# Altium project Zotino.PrjPCB (part 2 of 3)

## Sheet Supply_DAC.SchDoc: Zotino
size 420 x 297 mm; Author: G.K.; CompanyName: WUT; DrawnBy: G.K.; Organization: WUT ISE; Address1: Warsaw Univeristy of Technology; Address2: Nowowiejska 15/19; DocumentNumber: 6; Revision: 1.4.3; SheetNumber: 6; SheetTotal: 6; EDA_Number: ARTIQ; Projet: Zotino; ModifiedBy: -; CreateDate: XX/XX/XXXX; CheckedDate: -; Title2: Power supply; DivGrp: ISE; Designer: G.K.; ModifiedDate: -; ProjectName: 32 CHANNEL 16bit DAC
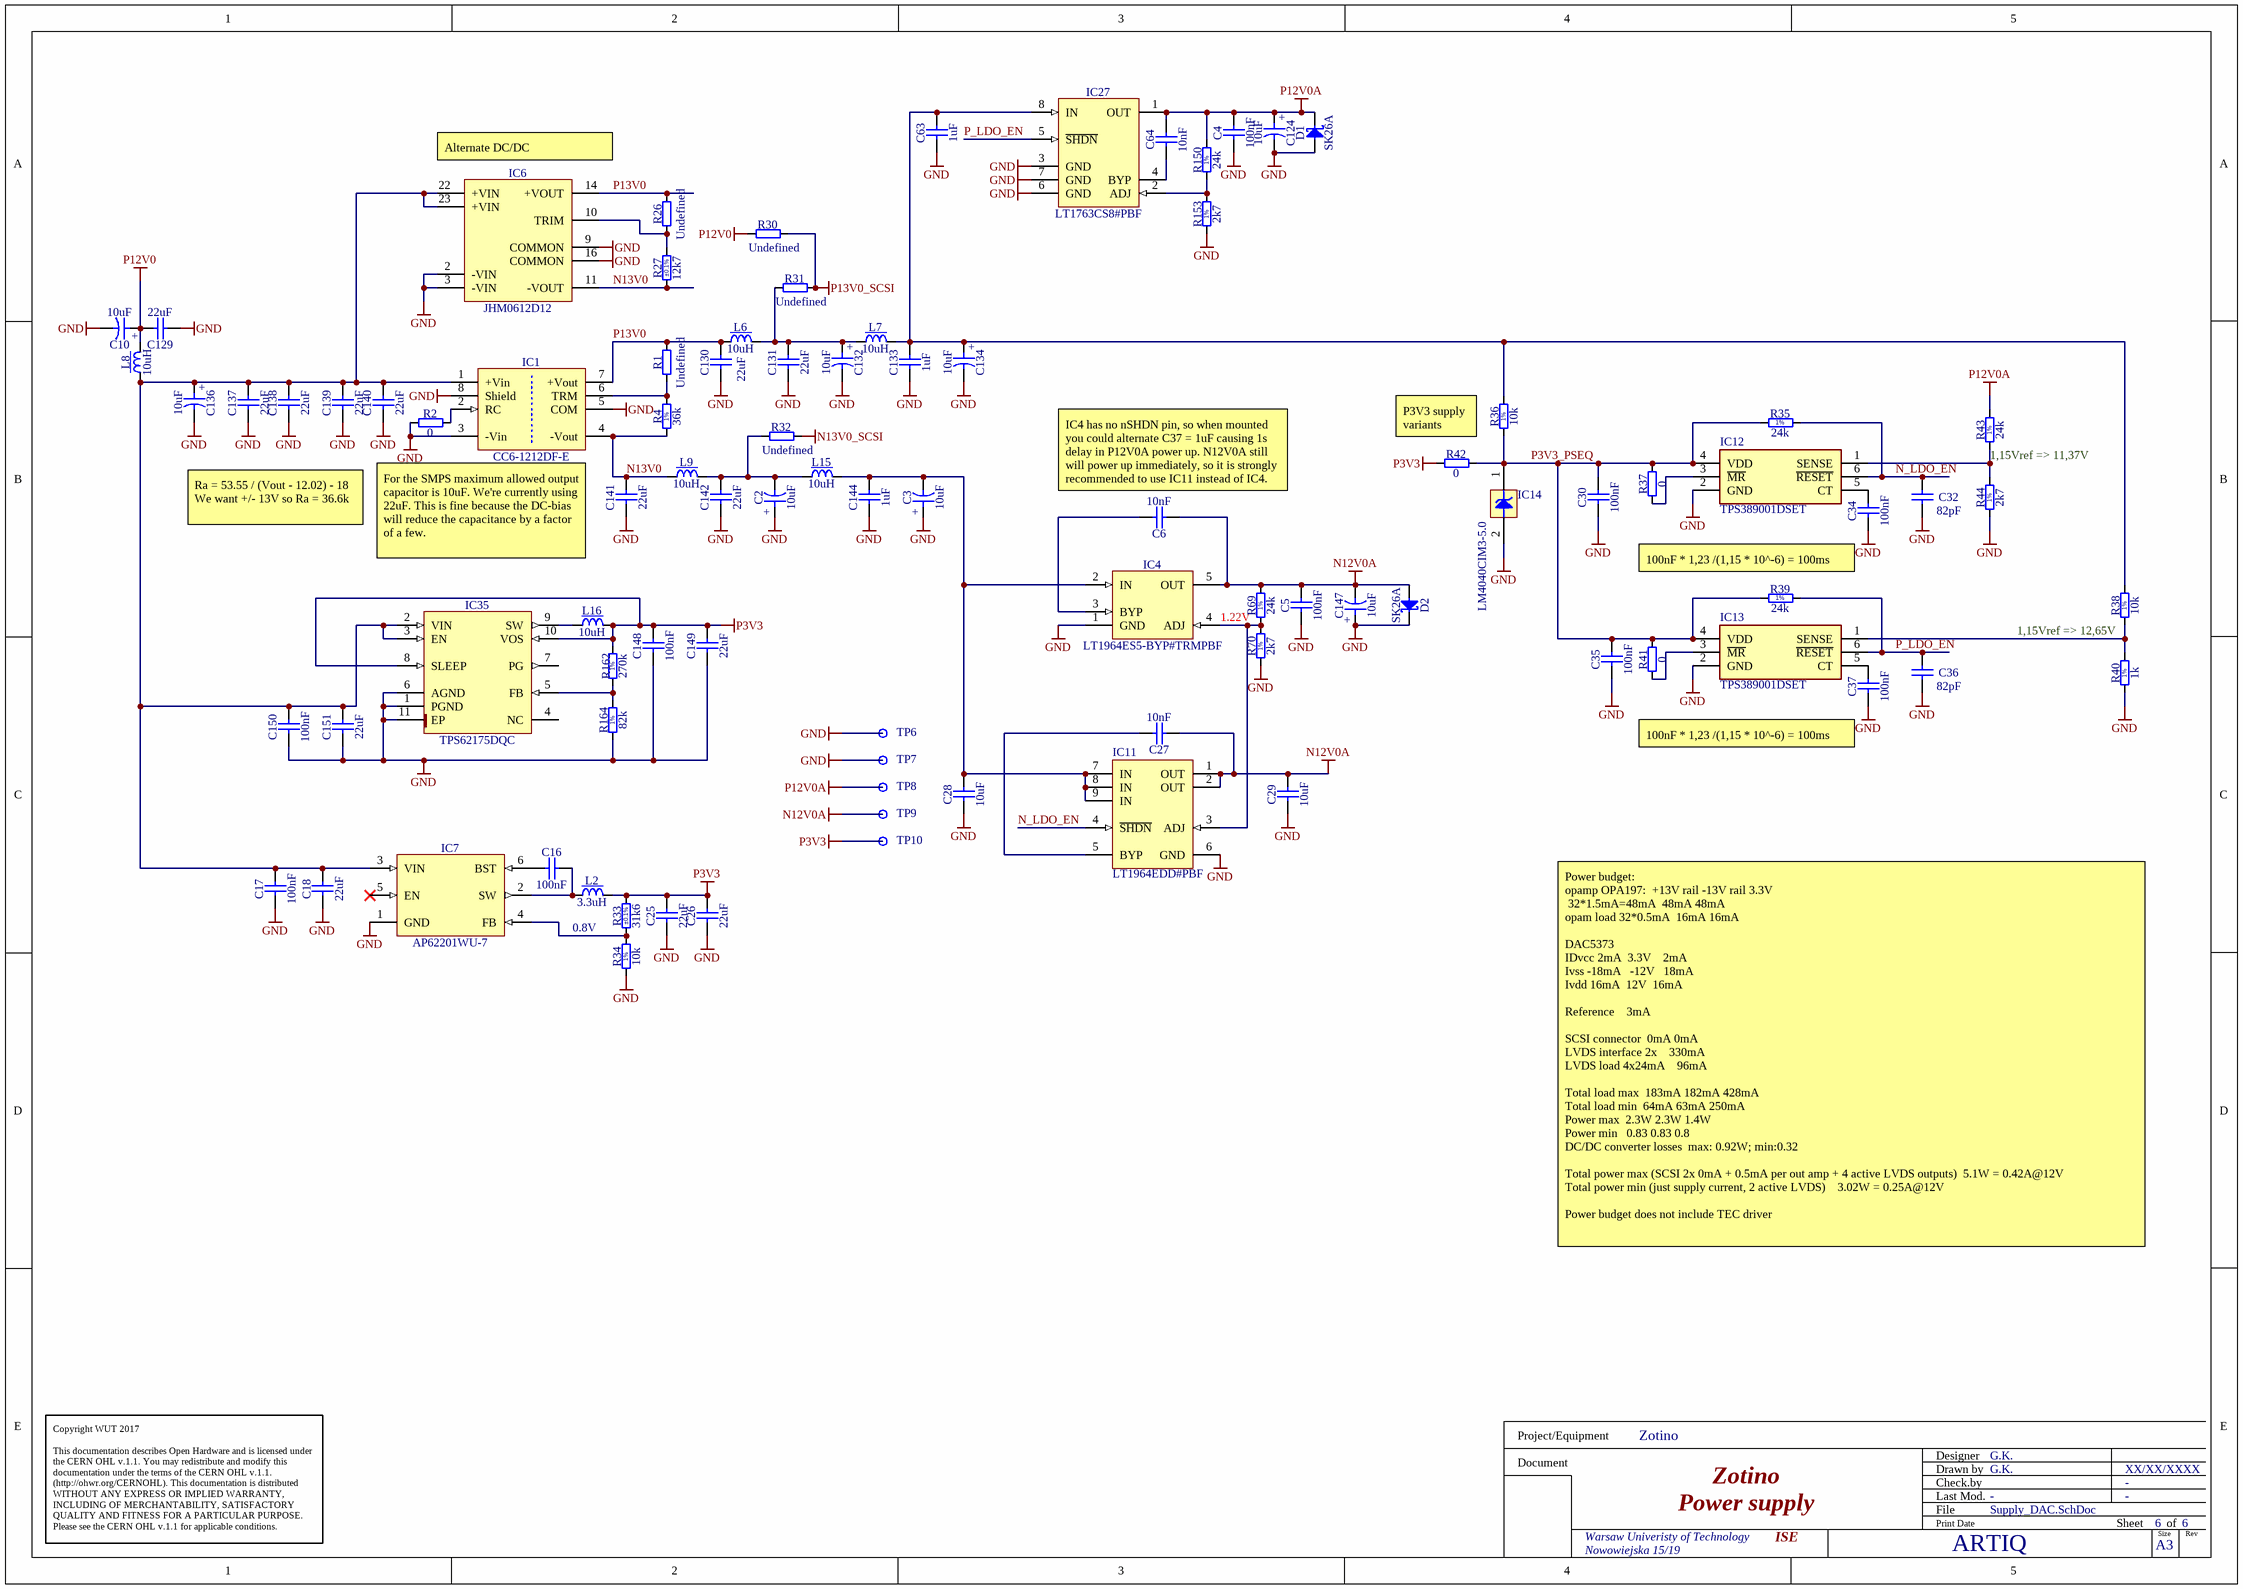
[diagram p1: Supply_DAC.SchDoc]

### Parts
C2  10uF  [CAPMP3216X180N]
C3  10uF  [CAPMP3216X180N]
C4  100nF  [CAPC1005X55N]
C5  100nF  [CAPC1005X55N]
C6  10nF  [CAPC1608X87N]
C10  10uF  [CAPMP3216X180N]
C16  100nF  [CAPC1005X55N]
C17  100nF  [CAPC1005X55N]
C18  22uF  [CAPC2012X135N]
C25  22uF  [CAPC2012X135N]
C26  22uF  [CAPC2012X135N]
C27  10nF  [CAPC1608X87N]
C28  10uF  [CAPC1608X80N]
C29  10uF  [CAPC1608X80N]
C30  100nF  [CAPC1005X55N]
C32  82pF  [CAPC1608X87N]
C34  100nF  [CAPC1005X55N]
C35  100nF  [CAPC1005X55N]
C36  82pF  [CAPC1608X87N]
C37  100nF  [CAPC1005X55N]
C63  1uF  [CAPC1608X87N]
C64  10nF  [CAPC1608X87N]
C124  10uF  [CAPMP3216X180N]
C129  22uF  [CAPC2012X135N]
C130  22uF  [CAPC2012X135N]
C131  22uF  [CAPC2012X135N]
C132  10uF  [CAPMP3216X180N]
C133  1uF  [CAPC1608X87N]
C134  10uF  [CAPMP3216X180N]
C136  10uF  [CAPMP3216X180N]
C137  22uF  [CAPC2012X135N]
C138  22uF  [CAPC2012X135N]
C139  22uF  [CAPC2012X135N]
C140  22uF  [CAPC2012X135N]
C141  22uF  [CAPC2012X135N]
C142  22uF  [CAPC2012X135N]
C144  1uF  [CAPC1608X87N]
C147  10uF  [CAPMP3216X180N]
C148  100nF  [CAPC1005X55N]
C149  22uF  [CAPC2012X135N]
C150  100nF  [CAPC1005X55N]
C151  22uF  [CAPC2012X135N]
D1  SK26A  [DIOM5126X265N]
D2  SK26A  [DIOM5126X265N]
IC1  CC6-1212DF-E  [CC6-1212DF-E]
IC4  LT1964ES5-BYP#TRMPBF  [SOT95P280X100-5N]
IC6  JHM0612D12  [DCDC_XPPOWER_JHM0X]
IC7  AP62201WU-7  [SOT95P280X100-6N]
IC11  LT1964EDD#PBF  [LT-DD-8_V]
IC12  TPS389001DSET  [TPS610985DSET]
IC13  TPS389001DSET  [TPS610985DSET]
IC14  LM4040CIM3-5.0  [SOT95P237X112-3N]
IC27  LT1763CS8#PBF  [SOIC127P600X175-8N]
IC35  TPS62175DQC  [SON50P200X300X80-11N-R94X250]
L2  3.3uH  [IND_WURTH_WE-TPC_4828]
L6  10uH  [IND_MURATA-PS_8400]
L7  10uH  [IND_MURATA-PS_8400]
L8  10uH  [IND_MURATA-PS_8400]
L9  10uH  [IND_MURATA-PS_8400]
L15  10uH  [IND_MURATA-PS_8400]
L16  10uH  [IND_MURATA-PS_8400]
R1  Undefined  [RESC1608X55N]
R2  0  [RESC1005X40N]
R4  36k  [RESC1608X55N]
R26  Undefined  [RESC1608X55N]
R27  12k7  Tolerance: ±0.1%  [RESC1608X55N]
R30  Undefined  [RESC3216X65N]
R31  Undefined  [RESC3216X65N]
R32  Undefined  [RESC3216X65N]
R33  31k6  Tolerance: ±0.1%  [RESC1005X35N]
R34  10k  [RESC1005X40N]
R35  24k  [RESC1608X55N]
R36  10k  [RESC1005X40N]
R37  0  [RESC1005X40N]
R38  10k  [RESC1005X40N]
R39  24k  [RESC1608X55N]
R40  1k  [RESC1608X55N]
R41  0  [RESC1005X40N]
R42  0  [RESC1005X40N]
R43  24k  [RESC1608X55N]
R44  2k7  [RESC1608X55N]
R69  24k  [RESC1608X55N]
R70  2k7  [RESC1608X55N]
R150  24k  [RESC1608X55N]
R153  2k7  [RESC1608X55N]
R162  270k  [RESC1608X55N]
R164  82k  [RESC1608X55N]
TP6  Test Point  [TPS127]  (value not drawn)  (no BOM)
TP7  Test Point  [TPS127]  (value not drawn)  (no BOM)
TP8  Test Point  [TPS127]  (value not drawn)  (no BOM)
TP9  Test Point  [TPS127]  (value not drawn)  (no BOM)
TP10  Test Point  [TPS127]  (value not drawn)  (no BOM)

### Nets
GND: C2.1 C3.1 C4.1 C5.1 C10.2 C17.1 C18.1 C25.1 C26.1 C28.1 C29.1 C30.1 C32.1 C34.1 C35.1 C36.1 C37.1 C63.1 C124.2 C129.1 C130.1 C131.1 C132.2 C133.1 C134.2 C136.2 C137.1 C138.1 C139.1 C140.1 C141.1 C142.1 C144.1 C147.1 C148.1 C149.1 C150.1 C151.1 D1.2(A) D2.1(C) IC1.3(-Vin) IC1.5(COM) IC1.8(Shield) IC4.1(GND) IC6.2(-VIN) IC6.3(-VIN) IC6.9(COMMON) IC6.16(COMMON) IC7.1(GND) IC11.6(GND) IC12.2(GND) IC13.2(GND) IC14.2(A) IC27.3(GND) IC27.6(GND) IC27.7(GND) IC35.1(PGND) IC35.6(AGND) IC35.11(EP) R2.1 R34.1 R40.1 R44.1 R70.1 R153.1 R164.1 TP6.1 TP7.1
N12V0A: C5.2 C6.1 C27.1 C29.2 C147.2 D2.2(A) IC4.5(OUT) IC11.1(OUT) IC11.2(OUT) R69.2 TP9.1
N13V0_SCSI: R32.2
P3V3: C25.2 C26.2 C148.2 C149.2 IC35.8(SLEEP) IC35.10(VOS) L2.2 L16.2 R33.2 R42.1 R162.2 TP10.1
P12V0: C10.1 C129.2 L8.2 R30.1
P12V0A: C4.2 C64.2 C124.1 D1.1(C) IC27.1(OUT) R43.2 R150.2 TP8.1
P13V0_SCSI: R30.2 R31.2
N13V0: C141.2 IC1.4(-Vout) IC6.11(-VOUT) L9.1 R4.1 R27.1
N_LDO_EN: C32.2 IC11.4(~{SHDN}) IC12.6(~{RESET}) R35.2
P3V3_PSEQ: C30.2 C35.2 IC12.4(VDD) IC13.4(VDD) IC14.1(C) R35.1 R36.1 R37.2 R39.1 R41.2 R42.2
P13V0: C130.2 IC1.7(+Vout) IC6.14(+VOUT) L6.1 R1.2 R26.2
P_LDO_EN: C36.2 IC13.6(~{RESET}) IC27.5(~{SHDN}) R39.2
NetC2_2: C2.2 C142.2 L9.2 L15.1 R32.1
NetC3_2: C3.2 C28.2 C144.2 IC4.2(IN) IC11.7(IN) IC11.8(IN) IC11.9(IN) L15.2
NetC6_2: C6.2 IC4.3(BYP)
NetC16_1: C16.1 IC7.6(BST)
NetC16_2: C16.2 IC7.2(SW) L2.1
NetC17_2: C17.2 C18.2 C136.1 C137.2 C138.2 C139.2 C140.2 C150.2 C151.2 IC1.1(+Vin) IC6.22(+VIN) IC6.23(+VIN) IC7.3(VIN) IC35.2(VIN) IC35.3(EN) L8.1
NetC27_2: C27.2 IC11.5(BYP)
NetC34_2: C34.2 IC12.5(CT)
NetC37_2: C37.2 IC13.5(CT)
NetC63_2: C63.2 C133.2 C134.1 IC27.8(IN) L7.2 R36.2 R38.2
NetC64_1: C64.1 IC27.4(BYP)
NetC131_2: C131.2 C132.1 L6.2 L7.1 R31.1
NetIC1_2: IC1.2(RC) R2.2
NetIC1_6: IC1.6(TRM) R1.1 R4.2
NetIC4_4: IC4.4(ADJ) IC11.3(ADJ) R69.1 R70.2
NetIC6_10: IC6.10(TRIM) R26.1 R27.2
NetIC7_4: IC7.4(FB) R33.1 R34.2
NetIC12_1: IC12.1(SENSE) R43.1 R44.2
NetIC12_3: IC12.3(~{MR}) R37.1
NetIC13_1: IC13.1(SENSE) R38.1 R40.2
NetIC13_3: IC13.3(~{MR}) R41.1
NetIC27_2: IC27.2(ADJ) R150.1 R153.2
NetIC35_5: IC35.5(FB) R162.1 R164.2
NetIC35_9: IC35.9(SW) L16.1

Not connected (* = marked no-connect by the designer): IC7 5(EN)*; IC35 4(NC) 7(PG)

### Notes on the sheet
- (near IC6) Alternate DC/DC
  Trim +10%, R27=12.8k
- P3V3 supply
  variants
- (near R43) 1,15Vref => 11,37V
- Ra = 53.55 / (Vout - 12.02) - 18
  We want +/- 13V so Ra = 36.6k
- (near C6) IC4 has no nSHDN pin, so when mounted you could alternate C37 = 1uF causing 1s delay in P12V0A power up. N12V0A still will power up immediately, so it is strongly recommended to use IC11 instead of IC4.
- For the SMPS maximum allowed output capacitor is 10uF. We're currently using 22uF. This is fine because the DC-bias will reduce the capacitance by a factor of a few.
- 100nF * 1,23 /(1,15 * 10^-6) = 100ms
- 1.22V
- (near R38) 1,15Vref => 12,65V
- 0.8V
- Power budget:
  opamp OPA197:		+13V rail	-13V rail	3.3V
  32*1.5mA=48mA		48mA	48mA
  opam load	32*0.5mA		16mA	16mA
  DAC5373
  IDvcc 2mA  3.3V				2mA
  Ivss -18mA   -12V			18mA
  Ivdd 16mA  12V		16mA
  Reference 			3mA
  SCSI connector		0mA	0mA
  LVDS interface 2x				330mA
  LVDS load 4x24mA				96mA
  Total load	max		183mA	182mA	428mA
  Total load min		64mA	63mA	250mA
  Power max		2.3W	2.3W	1.4W
  Power min			0.83	0.83	0.8
  DC/DC converter losses 	max: 0.92W; min:0.32
  Total power max (SCSI 2x 0mA + 0.5mA per out amp + 4 active LVDS outputs) 	5.1W = 0.42A@12V
  Total power min (just supply current, 2 active LVDS)				3.02W = 0.25A@12V
  Power budget does not include TEC driver
- Copyright WUT 2017
  This documentation describes Open Hardware and is licensed under the CERN OHL v.1.1. You may redistribute and modify this documentation under the terms of the CERN OHL v.1.1. (http://ohwr.org/CERNOHL). This documentation is distributed WITHOUT ANY EXPRESS OR IMPLIED WARRANTY, INCLUDING OF MERCHANTABILITY, SATISFACTORY QUALITY AND FITNESS FOR A PARTICULAR PURPOSE. Please see the CERN OHL v.1.1 for applicable conditions.
- Project/Equipment
- Document
- Designer
- Drawn by
- Check.by
- File
- Last Mod.
- Print Date
- Sheet
- Size
- A3
- of
- Rev
- (in symbol CTE3216-18_10UF_16V_20%_AVX_TCJ) +
- (in symbol R0402_10K_1%_0.0625W_100PPM) 1%
- (in symbol R0603_1K_1%_0.1W_100PPM) 1%
- (in symbol R0603_2K7_1%_0.1W_100PPM) 1%
- (in symbol R0603_24K_1%_0.1W_100PPM) 1%
- (in symbol R0603_36K_1%_0.1W_100PPM) 1%
- (in symbol R0603_82K_1%_0.1W_100PPM) 1%
- (in symbol R0603_270K_1%_0.1W_100PPM) 1%

### Library data of the parts
C2 C3 C10 C124 C132 C134 C136 C147 = CTE3216-18_10UF_16V_20%_AVX_TCJ: Polarised capacitor; Part Description: ESR 0R200 Tantalum Solid Electrolytic Chip Capacitor with Conductive Polymer Electrode; Manufacturer: AVX; Manufacturer Part Number: TCJA106M016R0200; Voltage: 16V; Tolerance: ±20%; Part Number: CTE3216-18_10UF_16V_20%_AVX_TCJ; Component Kind: Standard; Component Type: Standard; Pin Count: 2; Value: 10uF; Status: Preferred; Case: A; Mounted: Yes; Socket: No; SMD: Yes; Sense: No; ComponentHeight: 1.8mm; HelpURL: \\cern.ch\dfs\Applications\Altium\Datasheets\CTE_AVX_TCJ.pdf; Author: CERN DEM JLC; CreateDate: 29.03.2012; LatestRevisionDate: 29.03.2012
C4 C5 C16 C17 C30 C34 C35 C37 C148 C150 = CC0402_100NF_16V_10%_X5R: Non-polarised capacitor; Part Description: SMD Multilayer Chip Ceramic Capacitor; Manufacturer: GENERIC; Manufacturer1 Part Number: GRM155R61C104KA88D; Voltage: 16V; TC: X5R; Tolerance: ±10%; Part Number: CC0402_100NF_16V_10%_X5R; Component Kind: Standard; Component Type: Standard; Pin Count: 2; Value: 100nF; Status: None; Manufacturer Part Number: CC0402_100NF_16V_10%_X5R; Case: 0402; Mounted: Yes; Socket: No; SMD: Yes; Sense: No; Manufacturer1 Example: MURATA; Manufacturer1 ComponentHeight: 0.55mm; HelpURL: \\cern.ch\dfs\Applications\Altium\Datasheets\CC0402_X5R_MURATA_GRM.pdf; Author: CERN DEM JLC; CreateDate: 10.12.2013; LatestRevisionDate: 10.12.2013
C6 C27 C64 = CC0603_10NF_50V_10%_X7R: Non-polarised capacitor; Part Description: SMD Multilayer Chip Ceramic Capacitor; Manufacturer: GENERIC; Manufacturer1 Part Number: 223858615636; Voltage: 50V; TC: X7R; Tolerance: ±10%; Part Number: CC0603_10NF_50V_10%_X7R; Component Kind: Standard; Component Type: Standard; Pin Count: 2; Value: 10nF; Status: Preferred; Manufacturer Part Number: CC0603_10NF_50V_10%_X7R; Case: 0603; Mounted: Yes; Socket: No; SMD: Yes; Sense: No; Manufacturer1 Example: PHYCOMP; Manufacturer1 ComponentHeight: 0.87mm; HelpURL: \\cern.ch\dfs\Applications\Altium\Datasheets\CC0603_X7R_PHYCOMP.pdf; Author: CERN DEM JLC; CreateDate: 03.12.2007; LatestRevisionDate: 03.12.2007
C18 C25 C26 C129-C131 C137-C142 C149 C151 = CC0805_22UF_16V_10%_X5R: Non-polarised capacitor; Part Description: SMD Multilayer Chip Ceramic Capacitor; Manufacturer: GENERIC; Manufacturer1 Part Number: C2012X5R1C226KT; Voltage: 16V; TC: X5R; Tolerance: ±10%; Part Number: CC0805_22UF_16V_10%_X5R; Component Kind: Standard; Component Type: Standard; Pin Count: 2; Value: 22uF; Status: Preferred; Manufacturer Part Number: CC0805_22UF_16V_10%_X5R; Case: 0805; Mounted: Yes; Socket: No; SMD: Yes; Sense: No; Manufacturer1 Example: TDK; Manufacturer1 ComponentHeight: 1.35mm; HelpURL: \\cern.ch\dfs\Applications\Altium\Datasheets\CC0805_X5R_TDK_C.pdf; Author: CERN DEM JLC; CreateDate: 25.10.2012; LatestRevisionDate: 25.10.2012
C28 C29 = CC0603_10UF_16V_20%_X5R: Non-polarised capacitor; Part Description: SMD Multilayer Chip Ceramic Capacitor; Manufacturer: GENERIC; Manufacturer1 Part Number: GRM188R61C106MA73D; Voltage: 16V; TC: X5R; Tolerance: ±20%; Part Number: CC0603_10UF_16V_20%_X5R; Component Kind: Standard; Component Type: Standard; Pin Count: 2; Value: 10uF; Status: None; Manufacturer Part Number: CC0603_10UF_16V_20%_X5R; Case: 0603; Mounted: Yes; Socket: No; SMD: Yes; Sense: No; Manufacturer1 Example: MURATA; Manufacturer1 ComponentHeight: 0.8mm; HelpURL: \\cern.ch\dfs\Applications\Altium\Datasheets\CC0603_X5R_MURATA_GRM.pdf; Author: CERN DEM MR; CreateDate: 02.03.2016; LatestRevisionDate: 02.03.2016
C32 C36 = CC0603_82PF_50V_5%_NP0: Non-polarised capacitor; Part Description: SMD Multilayer Chip Ceramic Capacitor; Manufacturer: GENERIC; Manufacturer1 Part Number: 223886715829; Voltage: 50V; TC: C0G/NP0; Tolerance: ±5%; Part Number: CC0603_82PF_50V_5%_NP0; Component Kind: Standard; Component Type: Standard; Pin Count: 2; Value: 82pF; Status: Preferred; Manufacturer Part Number: CC0603_82PF_50V_5%_NP0; Case: 0603; Mounted: Yes; Socket: No; SMD: Yes; Sense: No; Manufacturer1 Example: PHYCOMP; Manufacturer1 ComponentHeight: 0.87mm; HelpURL: \\cern.ch\dfs\Applications\Altium\Datasheets\CC0603_NP0_PHYCOMP.pdf; Author: CERN DEM JLC; CreateDate: 03.12.2007; LatestRevisionDate: 03.12.2007
C63 C133 C144 = CC0603_1UF_25V_10%_X7R: Non-polarised capacitor; Part Description: SMD Multilayer Chip Ceramic Capacitor; Manufacturer: GENERIC; Manufacturer1 Part Number: GRM188R71E105KA12D; Voltage: 25V; TC: X7R; Tolerance: ±10%; Part Number: CC0603_1UF_25V_10%_X7R; Component Kind: Standard; Component Type: Standard; Pin Count: 2; Value: 1uF; Status: None; Manufacturer Part Number: CC0603_1UF_25V_10%_X7R; Case: 0603; Mounted: Yes; Socket: No; SMD: Yes; Sense: No; Manufacturer1 Example: MURATA; Manufacturer1 ComponentHeight: 0.9mm; HelpURL: \\cern.ch\dfs\Applications\Altium\Datasheets\CC0603_X7R_MURATA.pdf; Author: CERN DEM JLC; CreateDate: 18.01.2011; LatestRevisionDate: 18.01.2011
D1 D2 = SK26A: Schottky Diode; Part Description: 2A, 60V Surface Mount Schottky Barrier Rectifier; Manufacturer: TAIWAN SEMICONDUCTOR; Voltage: 60V; Power: 2A; PressFit: No; Bonding: No; Part Number: SK26A; Component Kind: Standard; Component Type: Standard; Device: SK26A; PackageDescription: DO-214-AC/SMA Molded Diode, 2-Leads, Body 5.1x2.6mm, IPC Medium Density; Manufacturer Part Number: SK26A; Pin Count: 2; Case: DO-214AC; Mounted: Yes; Socket: No; SMD: Yes; Sense: No; ComponentHeight: 2.5mm; HelpURL: \\cern.ch\dfs\Applications\Altium\Datasheets\SK26A.pdf; Author: CERN DEM JMW; CreateDate: 07.08.2015; LatestRevisionDate: 07.08.2015
IC1 = DC/DC_CC6-1212DF-E: CONV DC/DC 6W DUAL 12V +-12V PCB; Manufacturer: TDK-Lambda Americas Inc.; PressFit: No; Bonding: No; Part Number: CC6-1212DF-E; Component Kind: Standard; Component Type: Standard; Device: CC6-1212DF-E; PackageDescription: CC6 Series, Body 0.900 x 0.831 x 0.335, Regulated; Part Description: CONV DC/DC 6W DUAL 12V +-12V PCB; Manufacturer Part Number: CC6-1212DF-E; Pin Count: 7; Mounted: Yes; Socket: No; SMD: No; Sense: No; ComponentHeight: 10.45mm; Author: GK; CreateDate: 17.12.2016; LatestRevisionDate: 17.12.2016
IC4 = LT1964ES5-BYP#TRMPBF: 200mA, Low Noise, Low Dropout Negative Micropower Regulator; Part Description: -1.22V to -20V, 200mA, Low Noise, Low Dropout Negative Micropower Regulator; Manufacturer: LINEAR TECHNOLOGY; PressFit: No; Bonding: No; Part Number: LT1964ES5-BYP#TRMPBF; Component Kind: Standard; Component Type: Standard; Device: LT1964ES5-BYP#TRMPBF; PackageDescription: SOT23, 0.95mm pitch; 5 pin, 1.75mm W X 3.00mm L, IPC Medium Density; Manufacturer Part Number: LT1964ES5-BYP#TRMPBF; Pin Count: 5; Case: SOT23-5; Mounted: Yes; Socket: No; SMD: Yes; Sense: No; ComponentHeight: 1mm; HelpURL: \\cern.ch\dfs\Applications\Altium\Datasheets\LT1964ES5-BYP#TRMPBF.pdf; Author: CERN DEM MR; CreateDate: 17.02.2016; LatestRevisionDate: 17.02.2016
IC6 = JHM0612D12: 9-72VDC to 3.3-15VDC, Iout (max) 500mA, DC-DC Converter; Part Description: 10-17V to  ±12V ( ±250mA)  Power Supply; Manufacturer: XP POWER; PressFit: No; Bonding: No; Part Number: JHM0612D12; Component Kind: Standard; Component Type: Standard; Device: JHM0612D12; PackageDescription: JHM Series , Body 31.75 x 20.32mm; Status: None; Manufacturer Part Number: JHM0612D12; Pin Count: 9; Mounted: Yes; Socket: No; SMD: No; Sense: No; ComponentHeight: 10.4mm; HelpURL: \\cern.ch\dfs\Applications\Altium\Datasheets\JHM0X.pdf; Author: CERN DEM HF; CreateDate: 12.07.2022; LatestRevisionDate: 12.07.2022
IC7 = AP62201WU-7: 4.2V TO 18V INPUT, 2A LOW IQ SYNCHRONOUS BUCK CONVERTER; Manufacturer: DIODES INCORPORATED; PressFit: No; Bonding: No; Part Number: AP62201WU-7; Component Kind: Standard; Component Type: Standard; Device: AP62201WU-7; PackageDescription: SOT23, 0.95mm Pitch; 6 Pin, 1.625mm W X 2.90mm L X 1.00mm H body, IPC Medium Density; Part Description: 4.2V To 18V Input, 2A Low Iq Synchronous Buck Converter; Manufacturer Part Number: AP62201WU; Pin Count: 6; Case: SOT23-6; Mounted: Yes; Socket: No; SMD: Yes; Sense: No; ComponentHeight: 1.1mm; HelpURL: \\cern.ch\dfs\Applications\Altium\Datasheets\AP6220x.pdf; Author: CERN DEM HF; CreateDate: 07.01.2022; LatestRevisionDate: 21.03.2022
IC11 = CMP-0476-00219-1: 200 mA, Low Noise, Low Dropout Negative Micropower Regulator, -1.9 to -20 V Vin, Adjustable Vout, 8-pin SON (DD-8), -40 to 125 degC, Pb-Free; Manufacturer: Linear Technology; Output Voltage: Adj; Isupply(mA): 0.03; Dropout Voltage(V): 0.34; Vout Max(V): -1.22; Shutdown Current(uA): 3; Noise(uV): 30; Discrete Pass Element: no; Iout(mA): 200; Number of Outputs: 1; PSRR(dB): 54; ComponentLink3Description: Package Specification; PackageDescription: 8-Pin Plastic DFN, Body 3 x 3 mm, Pitch 0.5 mm; RoHS: TRUE; ComponentLink1Description: Manufacturer URL; Vin Max(V): -1.9; Vout Min(V): -20; Code_JEDEC: MO-229; ComponentLink1URL: http://www.linear.com/; PartNumber: LT1964EDD#PBF; PackageVersion: Jun-10; DatasheetVersion: Rev. B; PackageReference: DD-8; ComponentLink2Description: Datasheet; Vin Min(V): -20; ComponentLink3URL: http://cds.linear.com/docs/en/packaging/DFN_8_05-08-1698.pdf; ComponentLink2URL: http://cds.linear.com/docs/en/datasheet/1964fb.pdf; Mounting Technology: Surface Mount
IC12 IC13 = TPS389001DSET: Supervisory Circuits Low-quiescent current 1% accuracy supervisor with programmable delay; Manufacturer_Name: Texas Instruments; Datasheet Link: https://www.ti.com/general/docs/suppproductinfo.tsp?distId=10&gotoUrl=https%3A%2F%2Fwww.ti.com%2Flit%2Fgpn%2Ftps3890; Height: 0.8mm; Manufacturer Part Number: TPS389001DSET; Mouser Part Number: 595-TPS389001DSET; Mouser Price/Stock: https://www.mouser.co.uk/ProductDetail/Texas-Instruments/TPS389001DSET?qs=dSktwyqbRaUv%2FgF0PRoIcw%3D%3D
IC14 = LM4040CIM3-5.0: Integrated Circuit; Manufacturer_Name: Texas Instruments; Datasheet Link: http://www.ti.com/lit/ds/symlink/lm4040-n.pdf; Height: 1.12mm; Manufacturer Part Number: LM4040CIM3-5.0; Mouser Part Number: 926-LM4040CIM3-50; Mouser Price/Stock: https://www.mouser.co.uk/ProductDetail/Texas-Instruments/LM4040CIM3-50?qs=QbsRYf82W3GkYEk3maEP0Q%3D%3D; Arrow Part Number: LM4040CIM3-5.0; Arrow Price/Stock: https://www.arrow.com/en/products/lm4040cim3-5.0/texas-instruments?region=nac
IC27 = LT1763CS8#PBF: 1.22V to 20V 500mA, Low Noise, LDO Adjustable Micropower Regulator; Manufacturer: LINEAR TECHNOLOGY; PressFit: No; Bonding: No; Part Number: LT1763CS8#PBF; Component Kind: Standard; Component Type: Standard; Device: LT1763CS8#PBF; PackageDescription: SOIC 8, Pitch 1.27mm, Body 4x5mm, IPC Medium Density; Part Description: 1.22V to 20V 500mA, Low Noise, LDO Adjustable Micropower Regulator; Manufacturer Part Number: LT1763CS8#PBF; Pin Count: 8; Case: SOIC8; Mounted: Yes; Socket: No; SMD: Yes; Sense: No; ComponentHeight: 1.75mm; HelpURL: \\cern.ch\dfs\Applications\Altium\Datasheets\LT1763CS8#PBF.pdf; Author: CERN DEM JLC; CreateDate: 11.01.2010; LatestRevisionDate: 11.01.2010
IC35 = TPS62175DQC: 4.75-28VDC to 1-6VDC, 500mA Step-Down Converter With Sleep Mode; Manufacturer: TEXAS INSTRUMENTS; PressFit: No; Bonding: No; Part Number: TPS62175DQC; Component Kind: Standard; Component Type: Standard; Device: TPS62175DQC; PackageDescription: SON, 10-Leads, Body 2x3mm, Pitch 0.5mm, Thermal Pad 0.94x2.5mm, IPC Medium Density; Part Description: 4.75-28VDC to 1-6VDC, 500mA Step-Down Converter With Sleep Mode; Manufacturer Part Number: TPS62175DQC; Pin Count: 11; Case: SON10; Mounted: Yes; Socket: No; SMD: Yes; Sense: No; ComponentHeight: 0.8mm; HelpURL: \\cern.ch\dfs\Applications\Altium\Datasheets\TPS62175DQC.pdf; Author: CERN DEM JMW; CreateDate: 11.08.2015; LatestRevisionDate: 11.08.2015
L2 = IND_3.3UH_30%_WURTH_WE-TPC_744043003: Inductor With Core; Part Description: Shielded Tiny Power Inductor (WE-TPC Serie); Manufacturer: WURTH ELEKTRONIK; Power: 2.15A; Resistance: 0.03R; Tolerance: ±30%; Part Number: IND_3.3UH_30%_WURTH_WE-TPC_744043003; Component Kind: Standard; Component Type: Standard; Pin Count: 2; Value: 3.3uH; Manufacturer Part Number: 744043003; Mounted: Yes; Socket: No; SMD: Yes; Sense: No; ComponentHeight: 3mm; HelpURL: \\cern.ch\dfs\Applications\Altium\Datasheets\IND_WURTH_WE-TPC_744043003.pdf; Author: CERN DEM JLC; CreateDate: 12.07.2011; LatestRevisionDate: 24.01.2012
L6-L9 L15 L16 = IND_10UH_10%_MURATA-PS_8400: Inductor With Core; Part Description: Miniature Surface Mount Power Inductor (8400 Serie); Manufacturer: MURATA POWER SOLUTIONS; Manufacturer Part Number: 84103C; Power: 950mA; Resistance: 0.24R; Tolerance: ±10%; Part Number: IND_10UH_10%_MURATA-PS_8400; Component Kind: Standard; Component Type: Standard; Pin Count: 2; Value: 10uH; Status: None; Mounted: Yes; Socket: No; SMD: Yes; Sense: No; ComponentHeight: 2.9mm; HelpURL: \\cern.ch\dfs\Applications\Altium\Datasheets\IND_MURATA-PS_8400.pdf; Author: CERN DEM JLC; CreateDate: 02.07.2012; LatestRevisionDate: 02.07.2012
R1 R26 = R0603_NO-VALUE: Resistor; Part Description: Reserved Footprint For a 0603 (1608) Chip Resistor; Mounted: No; Part Number: R0603_NO-VALUE; Component Kind: Standard; Component Type: Standard; Pin Count: 2; Value: Undefined; Status: None; Manufacturer: Undefined; Manufacturer Part Number: R0603_NO-VALUE; Case: 0603; Sense: No; Socket: No; SMD: Yes; Manufacturer1 Example: Undefined; Manufacturer1 Part Number: Undefined; Manufacturer1 ComponentHeight: Undefined; HelpURL: Undefined; Author: CERN DEM JLC; CreateDate: 03.12.2007; LatestRevisionDate: 13.03.2008
R2 R37 R41 R42 = R0402_0R_JUMPER: Resistor; Part Description: 1A (0.05R Max DC Resistance) Zero Ohm Jumper; Manufacturer: GENERIC; Manufacturer1 Part Number: 232270591001L; Part Number: R0402_0R_JUMPER; Component Kind: Standard; Component Type: Standard; Pin Count: 2; Value: 0; Status: Not recommended; Manufacturer Part Number: R0402_0R_JUMPER; Case: 0402; Mounted: Yes; Sense: No; Socket: No; SMD: Yes; Manufacturer1 Example: YAGEO PHYCOMP; Manufacturer1 ComponentHeight: 0.4mm; HelpURL: \\cern.ch\dfs\Applications\Altium\Datasheets\R0402_Phycomp_RC0402.pdf; Author: CERN DEM JLC; CreateDate: 03.12.2007; LatestRevisionDate: 17.10.2012
R4 = R0603_36K_1%_0.1W_100PPM: Resistor - 1%; Part Description: General Purpose Thick Film Chip Resistor; Manufacturer: GENERIC; Manufacturer1 Part Number: NRC06F3602TRF; Power: 0.1W; TC: ±100ppm/°C; PressFit: No; Part Number: R0603_36K_1%_0.1W_100PPM; Component Kind: Standard; Component Type: Standard; Pin Count: 2; Value: 36k; Status: Preferred; Tolerance: ±1%; Manufacturer Part Number: R0603_36K_1%_0.1W_100PPM; Case: 0603; Mounted: Yes; Sense: No; Socket: No; SMD: Yes; Manufacturer1 Example: NIC COMPONENT; Manufacturer1 ComponentHeight: 0.55mm; HelpURL: \\cern.ch\dfs\Applications\Altium\Datasheets\R0603_NIC_NRC.pdf; Author: CERN DEM JLC; CreateDate: 03.12.2007; LatestRevisionDate: 13.03.2008
R27 = R0603_12K7_0.1%_0.063W_10PPM: Resistor - 0.1%; Part Description: Thin Film Chip Resistor; Manufacturer: GENERIC; Manufacturer1 Part Number: RN73C1J12K7BTDF; Power: 0.063W; TC: ±10ppm; PressFit: No; Part Number: R0603_12K7_0.1%_0.063W_10PPM; Component Kind: Standard; Component Type: Standard; Pin Count: 2; Value: 12k7; Status: Not Recommended; Manufacturer Part Number: R0603_12K7_0.1%_0.063W_10PPM; Case: 0603; Mounted: Yes; Sense: No; Socket: No; SMD: Yes; Manufacturer1 Example: TYCO HOLSWORTHY; Manufacturer1 ComponentHeight: 0.5mm; HelpURL: \\cern.ch\dfs\Applications\Altium\Datasheets\R0603_Tyco_RN73.pdf; Author: CERN DEM JLC; CreateDate: 03.12.2007; LatestRevisionDate: 13.03.2008
R30-R32 = R1206_NO-VALUE: Resistor; Part Description: Reserved Footprint For a 1206 (3216) Chip Resistor; PressFit: No; Mounted: No; Part Number: R1206_NO-VALUE; Component Kind: Standard; Component Type: Standard; Pin Count: 2; Value: Undefined; Status: None; Manufacturer: Undefined; Manufacturer Part Number: R1206_NO-VALUE; Case: 1206; Sense: No; Socket: No; SMD: Yes; Manufacturer1 Example: Undefined; Manufacturer1 Part Number: Undefined; Manufacturer1 ComponentHeight: 0.65mm; HelpURL: Undefined; Author: CERN DEM JLC; CreateDate: 03.12.2007; LatestRevisionDate: 13.03.2008
R33 = R0402_31K6_0.1%_0.063W_25PPM_YAGEO_RT: Resistor - 0.1%; Part Description: Thin Film Chip Resistor; Manufacturer: YAGEO; Manufacturer Part Number: RT0402BRD0731K6L; Power: 0.063W; TC: ±25ppm/°C; Voltage: 50V; PressFit: No; Part Number: R0402_31K6_0.1%_0.063W_25PPM_YAGEO_RT; Component Kind: Standard; Component Type: Standard; Pin Count: 2; Value: 31k6; Status: Not Recommended; Case: 0402; Mounted: Yes; Sense: No; Socket: No; SMD: Yes; ComponentHeight: 0.35mm; HelpURL: \\cern.ch\dfs\Applications\Altium\Datasheets\R0402_YAGEO_RT.pdf; Author: CERN DEM BC; CreateDate: 30.07.2020; LatestRevisionDate: 30.07.2020
R34 R36 R38 = R0402_10K_1%_0.0625W_100PPM: Resistor - 1%; Part Description: General Purpose Thick Film Chip Resistor; Manufacturer: GENERIC; Manufacturer1 Part Number: 232270671003L; TC: ±100ppm/°C; Part Number: R0402_10K_1%_0.0625W_100PPM; Component Kind: Standard; Component Type: Standard; Pin Count: 2; Value: 10k; Status: Not recommended; Power: 0.0625W; Tolerance: ±1%; Manufacturer Part Number: R0402_10K_1%_0.0625W_100PPM; Case: 0402; Mounted: Yes; Sense: No; Socket: No; SMD: Yes; Manufacturer1 Example: YAGEO PHYCOMP; Manufacturer1 ComponentHeight: 0.4mm; HelpURL: \\cern.ch\dfs\Applications\Altium\Datasheets\R0402_Phycomp_RC0402.pdf; Author: CERN DEM JLC; CreateDate: 03.12.2007; LatestRevisionDate: 17.10.2012
R35 R39 R43 R69 R150 = R0603_24K_1%_0.1W_100PPM: Resistor - 1%; Part Description: General Purpose Thick Film Chip Resistor; Manufacturer: GENERIC; Manufacturer1 Part Number: NRC06F2402TRF; Power: 0.1W; TC: ±100ppm/°C; Part Number: R0603_24K_1%_0.1W_100PPM; Component Kind: Standard; Component Type: Standard; Pin Count: 2; Value: 24k; Status: Preferred; Tolerance: ±1%; Manufacturer Part Number: R0603_24K_1%_0.1W_100PPM; Case: 0603; Mounted: Yes; Sense: No; Socket: No; SMD: Yes; Manufacturer1 Example: NIC COMPONENT; Manufacturer1 ComponentHeight: 0.55mm; HelpURL: \\cern.ch\dfs\Applications\Altium\Datasheets\R0603_NIC_NRC.pdf; Author: CERN DEM JLC; CreateDate: 03.12.2007; LatestRevisionDate: 13.03.2008
R40 = R0603_1K_1%_0.1W_100PPM: Resistor - 1%; Part Description: General Purpose Thick Film Chip Resistor; Manufacturer: GENERIC; Manufacturer1 Part Number: NRC06F1001TRF; Power: 0.1W; TC: ±100ppm/°C; PressFit: No; Part Number: R0603_1K_1%_0.1W_100PPM; Component Kind: Standard; Component Type: Standard; Pin Count: 2; Value: 1k; Status: Preferred; Tolerance: ±1%; Manufacturer Part Number: R0603_1K_1%_0.1W_100PPM; Case: 0603; Mounted: Yes; Sense: No; Socket: No; SMD: Yes; Manufacturer1 Example: NIC COMPONENT; Manufacturer1 ComponentHeight: 0.55mm; HelpURL: \\cern.ch\dfs\Applications\Altium\Datasheets\R0603_NIC_NRC.pdf; Author: CERN DEM JLC; CreateDate: 03.12.2007; LatestRevisionDate: 13.03.2008
R44 R70 R153 = R0603_2K7_1%_0.1W_100PPM: Resistor - 1%; Part Description: General Purpose Thick Film Chip Resistor; Manufacturer: GENERIC; Manufacturer1 Part Number: RC0603FR-072K7L; Power: 0.1W; TC: ±100ppm/°C; Part Number: R0603_2K7_1%_0.1W_100PPM; Component Kind: Standard; Component Type: Standard; Pin Count: 2; Value: 2k7; Status: Preferred; Tolerance: ±1%; Manufacturer Part Number: R0603_2K7_1%_0.1W_100PPM; Case: 0603; Mounted: Yes; Sense: No; Socket: No; SMD: Yes; Manufacturer1 Example: YAGEO PHYCOMP; Manufacturer1 ComponentHeight: 0.55mm; HelpURL: \\cern.ch\dfs\Applications\Altium\Datasheets\R0603_PHYCOMP_RC0603.pdf; Author: CERN DEM JLC; CreateDate: 02.05.2011; LatestRevisionDate: 02.05.2011
R162 = R0603_270K_1%_0.1W_100PPM: Resistor - 1%; Part Description: General Purpose Thick Film Chip Resistor; Manufacturer: GENERIC; Manufacturer1 Part Number: NRC06F2703TRF; Power: 0.1W; TC: ±100ppm/°C; Part Number: R0603_270K_1%_0.1W_100PPM; Component Kind: Standard; Component Type: Standard; Pin Count: 2; Value: 270k; Status: Preferred; Tolerance: ±1%; Manufacturer Part Number: R0603_270K_1%_0.1W_100PPM; Case: 0603; Mounted: Yes; Sense: No; Socket: No; SMD: Yes; Manufacturer1 Example: NIC COMPONENT; Manufacturer1 ComponentHeight: 0.55mm; HelpURL: \\cern.ch\dfs\Applications\Altium\Datasheets\R0603_NIC_NRC.pdf; Author: CERN DEM JLC; CreateDate: 03.12.2007; LatestRevisionDate: 13.03.2008
R164 = R0603_82K_1%_0.1W_100PPM: Resistor - 1%; Part Description: General Purpose Thick Film Chip Resistor; Manufacturer: GENERIC; Manufacturer1 Part Number: NRC06F8202TRF; Power: 0.1W; TC: ±100ppm/°C; Part Number: R0603_82K_1%_0.1W_100PPM; Component Kind: Standard; Component Type: Standard; Pin Count: 2; Value: 82k; Status: Preferred; Tolerance: ±1%; Manufacturer Part Number: R0603_82K_1%_0.1W_100PPM; Case: 0603; Mounted: Yes; Sense: No; Socket: No; SMD: Yes; Manufacturer1 Example: NIC COMPONENT; Manufacturer1 ComponentHeight: 0.55mm; HelpURL: \\cern.ch\dfs\Applications\Altium\Datasheets\R0603_NIC_NRC.pdf; Author: CERN DEM JLC; CreateDate: 03.12.2007; LatestRevisionDate: 13.03.2008
TP6-TP10 = SMD_PAD_1.27X1.27MM: Part Description: 1.27mm x 1.27mm PCB Copper Area (SMD Test Point); Mounted: No; Part Number: SMD_PAD_1.27X1.27MM; Component Type: Standard (No BOM); Pin Count: 1; Family: Test Point; Socket: No; SMD: Yes; Sense: No; Status: None; ComponentHeight: 0mm; HelpURL: Undefined; Author: CERN DEM JLC; CreateDate: 12.01.2008; LatestRevisionDate: 12.01.2008; PackageDescription: 1.27mm x 1.27mm PCB Copper Area (SMD Test Point)

## Sheet Output_channel.SchDoc: Output
size 420 x 297 mm; Author: G.K.; CompanyName: WUT; DrawnBy: G.K.; Organization: WUT ISE; Address1: Warsaw Univeristy of Technology; Address2: Nowowiejska 15/19; DocumentNumber: 4; Revision: 1.4.3; SheetNumber: 4; SheetTotal: 6; EDA_Number: ARTIQ; Projet: Zotino; ModifiedBy: -; CreateDate: XX/XX/XXXX; CheckedDate: -; Title2: filter; DivGrp: ISE; Designer: G.K.; ModifiedDate: -; ProjectName: 32 CHANNEL 16bit DAC
Used 32 times, as channels U_Output_channel1, U_Output_channel2, U_Output_channel3, U_Output_channel4, U_Output_channel5, U_Output_channel6, U_Output_channel7, U_Output_channel8, U_Output_channel9, U_Output_channel10, U_Output_channel11, U_Output_channel12, U_Output_channel13, U_Output_channel14, U_Output_channel15, U_Output_channel16, U_Output_channel17, U_Output_channel18, U_Output_channel19, U_Output_channel20, U_Output_channel21, U_Output_channel22, U_Output_channel23, U_Output_channel24, U_Output_channel25, U_Output_channel26, U_Output_channel27, U_Output_channel28, U_Output_channel29, U_Output_channel30, U_Output_channel31, U_Output_channel32. Parts and nets are listed once, with the designators drawn on the sheet.
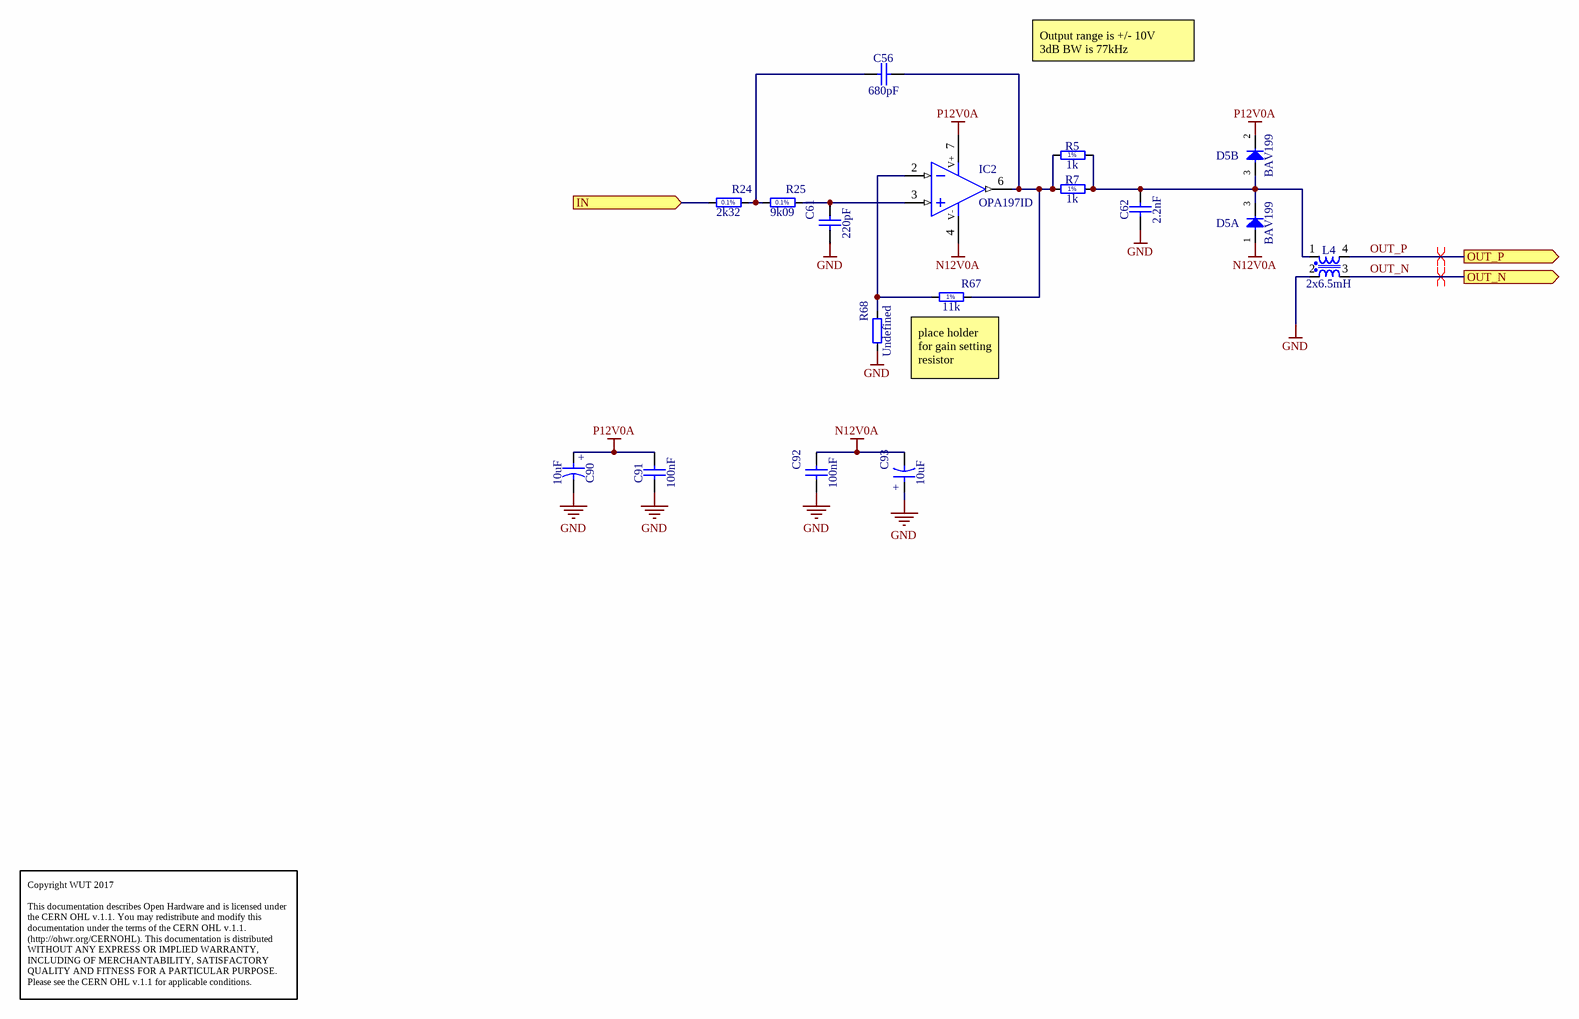
[diagram p2: Output_channel.SchDoc]

### Parts
C56  680pF  [CAPC2012X135N]
C61  220pF  [CAPC1608X87N]
C62  2.2nF  [CAPC3216X140N]
C90  10uF  [CAPMP3216X180N]
C91  100nF  [CAPC1005X55N]
C92  100nF  [CAPC1005X55N]
C93  10uF  [CAPMP3216X180N]
D5  BAV199  [SOT95P240X110-3N]  (parts A,B of 2)
IC2  OPA197ID  [SOIC127P600X175-8N]
L4  2x6.5mH  [IND_WURTH_WE-SL2]
R5  1k  [RESC1608X55N]
R7  1k  [RESC1608X55N]
R24  2k32  [RESC1608X55N]
R25  9k09  [RESC1608X55N]
R67  11k  [RESC1608X55N]
R68  Undefined  [RESC1608X55N]

### Ports
IN (in), OUT_N (out), OUT_P (out)

### Nets
GND: C61.1 C62.1 C90.2 C91.1 C92.1 C93.1 L4.2 R68.1
N12V0A: C92.2 C93.2 D5.1(A) IC2.4(V-)
P12V0A: C90.1 C91.2 D5.2(C) IC2.7(V+)
IN: R24.1 ; port IN
OUT_N: L4.3 ; port OUT_N
OUT_P: L4.4 ; port OUT_P
NetC56_1: C56.1 R24.2 R25.1
NetC56_2: C56.2 IC2.6(OUT) R5.1 R7.1 R67.2
NetC61_2: C61.2 IC2.3(IN+) R25.2
NetC62_2: C62.2 D5.3(COMAC) L4.1 R5.2 R7.2
NetIC2_2: IC2.2(IN-) R67.1 R68.2

### Channels
U_Output_channel1: designators end in _1; ports IN=VOUT1 OUT_N=DAC_OUT_N1 OUT_P=DAC_OUT_P1
U_Output_channel2: designators end in _2; ports IN=VOUT2 OUT_N=DAC_OUT_N2 OUT_P=DAC_OUT_P2
U_Output_channel3: designators end in _3; ports IN=VOUT3 OUT_N=DAC_OUT_N3 OUT_P=DAC_OUT_P3
U_Output_channel4: designators end in _4; ports IN=VOUT4 OUT_N=DAC_OUT_N4 OUT_P=DAC_OUT_P4
U_Output_channel5: designators end in _5; ports IN=VOUT5 OUT_N=DAC_OUT_N5 OUT_P=DAC_OUT_P5
U_Output_channel6: designators end in _6; ports IN=VOUT6 OUT_N=DAC_OUT_N6 OUT_P=DAC_OUT_P6
U_Output_channel7: designators end in _7; ports IN=VOUT7 OUT_N=DAC_OUT_N7 OUT_P=DAC_OUT_P7
U_Output_channel8: designators end in _8; ports IN=VOUT8 OUT_N=DAC_OUT_N8 OUT_P=DAC_OUT_P8
U_Output_channel9: designators end in _9; ports IN=VOUT9 OUT_N=DAC_OUT_N9 OUT_P=DAC_OUT_P9
U_Output_channel10: designators end in _10; ports IN=VOUT10 OUT_N=DAC_OUT_N10 OUT_P=DAC_OUT_P10
U_Output_channel11: designators end in _11; ports IN=VOUT11 OUT_N=DAC_OUT_N11 OUT_P=DAC_OUT_P11
U_Output_channel12: designators end in _12; ports IN=VOUT12 OUT_N=DAC_OUT_N12 OUT_P=DAC_OUT_P12
U_Output_channel13: designators end in _13; ports IN=VOUT13 OUT_N=DAC_OUT_N13 OUT_P=DAC_OUT_P13
U_Output_channel14: designators end in _14; ports IN=VOUT14 OUT_N=DAC_OUT_N14 OUT_P=DAC_OUT_P14
U_Output_channel15: designators end in _15; ports IN=VOUT15 OUT_N=DAC_OUT_N15 OUT_P=DAC_OUT_P15
U_Output_channel16: designators end in _16; ports IN=VOUT16 OUT_N=DAC_OUT_N16 OUT_P=DAC_OUT_P16
U_Output_channel17: designators end in _17; ports IN=VOUT17 OUT_N=DAC_OUT_N17 OUT_P=DAC_OUT_P17
U_Output_channel18: designators end in _18; ports IN=VOUT18 OUT_N=DAC_OUT_N18 OUT_P=DAC_OUT_P18
U_Output_channel19: designators end in _19; ports IN=VOUT19 OUT_N=DAC_OUT_N19 OUT_P=DAC_OUT_P19
U_Output_channel20: designators end in _20; ports IN=VOUT20 OUT_N=DAC_OUT_N20 OUT_P=DAC_OUT_P20
U_Output_channel21: designators end in _21; ports IN=VOUT21 OUT_N=DAC_OUT_N21 OUT_P=DAC_OUT_P21
U_Output_channel22: designators end in _22; ports IN=VOUT22 OUT_N=DAC_OUT_N22 OUT_P=DAC_OUT_P22
U_Output_channel23: designators end in _23; ports IN=VOUT23 OUT_N=DAC_OUT_N23 OUT_P=DAC_OUT_P23
U_Output_channel24: designators end in _24; ports IN=VOUT24 OUT_N=DAC_OUT_N24 OUT_P=DAC_OUT_P24
U_Output_channel25: designators end in _25; ports IN=VOUT25 OUT_N=DAC_OUT_N25 OUT_P=DAC_OUT_P25
U_Output_channel26: designators end in _26; ports IN=VOUT26 OUT_N=DAC_OUT_N26 OUT_P=DAC_OUT_P26
U_Output_channel27: designators end in _27; ports IN=VOUT27 OUT_N=DAC_OUT_N27 OUT_P=DAC_OUT_P27
U_Output_channel28: designators end in _28; ports IN=VOUT28 OUT_N=DAC_OUT_N28 OUT_P=DAC_OUT_P28
U_Output_channel29: designators end in _29; ports IN=VOUT29 OUT_N=DAC_OUT_N29 OUT_P=DAC_OUT_P29
U_Output_channel30: designators end in _30; ports IN=VOUT30 OUT_N=DAC_OUT_N30 OUT_P=DAC_OUT_P30
U_Output_channel31: designators end in _31; ports IN=VOUT31 OUT_N=DAC_OUT_N31 OUT_P=DAC_OUT_P31
U_Output_channel32: designators end in _32; ports IN=VOUT32 OUT_N=DAC_OUT_N32 OUT_P=DAC_OUT_P32

### Layout directives
differential pair: DAC_OUT_N1, DAC_OUT_P1

### Notes on the sheet
- Output range is +/- 10V
  3dB BW is 77kHz
- place holder for gain setting resistor
- Copyright WUT 2017
  This documentation describes Open Hardware and is licensed under the CERN OHL v.1.1. You may redistribute and modify this documentation under the terms of the CERN OHL v.1.1. (http://ohwr.org/CERNOHL). This documentation is distributed WITHOUT ANY EXPRESS OR IMPLIED WARRANTY, INCLUDING OF MERCHANTABILITY, SATISFACTORY QUALITY AND FITNESS FOR A PARTICULAR PURPOSE. Please see the CERN OHL v.1.1 for applicable conditions.
- Project/Equipment
- Document
- Designer
- Drawn by
- Check.by
- File
- Last Mod.
- Print Date
- Sheet
- Size
- A3
- of
- Rev
- (in symbol CTE3216-18_10UF_16V_20%_AVX_TCJ) +
- (in symbol R0603_1K_1%_0.1W_100PPM) 1%
- (in symbol R0603_2K32_0.1%_0.063W_10PPM) 0.1%
- (in symbol R0603_9K09_0.1%_0.063W_10PPM) 0.1%
- (in symbol R0603_11K_1%_0.1W_100PPM) 1%

### Library data of the parts
C56 = CC0805_680PF_50V_5%_NP0: Non-polarised capacitor; Part Description: SMD Multilayer Chip Ceramic Capacitor; Manufacturer: GENERIC; Manufacturer1 Part Number: 223886115681; Voltage: 50V; TC: C0G/NP0; Tolerance: ±5%; Part Number: CC0805_680PF_50V_5%_NP0; Component Kind: Standard; Component Type: Standard; Pin Count: 2; Value: 680pF; Status: Preferred; Manufacturer Part Number: CC0805_680PF_50V_5%_NP0; Case: 0805; Mounted: Yes; Socket: No; SMD: Yes; Sense: No; Manufacturer1 Example: PHYCOMP; Manufacturer1 ComponentHeight: 1.35mm; HelpURL: \\cern.ch\dfs\Applications\Altium\Datasheets\CC0805_NP0_PHYCOMP.pdf; Author: CERN DEM JLC; CreateDate: 03.12.2007; LatestRevisionDate: 03.12.2007
C61 = CC0603_220PF_50V_5%_NP0: Non-polarised capacitor; Part Description: SMD Multilayer Chip Ceramic Capacitor; Manufacturer: GENERIC; Manufacturer1 Part Number: 223886715221; Voltage: 50V; TC: C0G/NP0; Tolerance: ±5%; Part Number: CC0603_220PF_50V_5%_NP0; Component Kind: Standard; Component Type: Standard; Pin Count: 2; Value: 220pF; Status: Preferred; Manufacturer Part Number: CC0603_220PF_50V_5%_NP0; Case: 0603; Mounted: Yes; Socket: No; SMD: Yes; Sense: No; Manufacturer1 Example: PHYCOMP; Manufacturer1 ComponentHeight: 0.87mm; HelpURL: \\cern.ch\dfs\Applications\Altium\Datasheets\CC0603_NP0_PHYCOMP.pdf; Author: CERN DEM JLC; CreateDate: 03.12.2007; LatestRevisionDate: 03.12.2007
C62 = CC1206_2.2NF_50V_5%_NP0: Non-polarised capacitor; Part Description: SMD Multilayer Chip Ceramic Capacitor; Manufacturer: GENERIC; Manufacturer1 Part Number: 2238 863 15222; Voltage: 50V; TC: C0G/NP0; Tolerance: ±5%; Part Number: CC1206_2.2NF_50V_5%_NP0; Component Kind: Standard; Component Type: Standard; Pin Count: 2; Value: 2.2nF; Status: Preferred; Manufacturer Part Number: CC1206_2.2NF_50V_5%_NP0; Case: 1206; Mounted: Yes; Socket: No; SMD: Yes; Sense: No; Manufacturer1 Example: PHYCOMP; Manufacturer1 ComponentHeight: 1.25mm; HelpURL: \\cern.ch\dfs\Applications\Altium\Datasheets\CC1206_NP0_PHYCOMP.pdf; Author: CERN DEM JLC; CreateDate: 03.12.2007; LatestRevisionDate: 03.12.2007
C90 C93 = CTE3216-18_10UF_16V_20%_AVX_TCJ: as C2 on sheet Supply_DAC; Part Number: CTE3216-18_10UF_16V_20%_AVX_TCJ; Component Kind: Standard; Component Type: Standard; Pin Count: 2; Value: 10uF; Status: Preferred; Case: A; Mounted: Yes; Socket: No; SMD: Yes; Sense: No; ComponentHeight: 1.8mm; HelpURL: \\cern.ch\dfs\Applications\Altium\Datasheets\CTE_AVX_TCJ.pdf; Author: CERN DEM JLC; CreateDate: 29.03.2012; LatestRevisionDate: 29.03.2012
C91 C92 = CC0402_100NF_16V_10%_X7R: Non-polarised capacitor; Part Description: SMD Multilayer Chip Ceramic Capacitor; Manufacturer: GENERIC; Manufacturer1 Part Number: GRM155R71C104KA88D; Voltage: 16V; TC: X7R; Tolerance: ±10%; Part Number: CC0402_100NF_16V_10%_X7R; Component Kind: Standard; Component Type: Standard; Pin Count: 2; Value: 100nF; Status: Not Recommended; Manufacturer Part Number: CC0402_100NF_16V_10%_X7R; Case: 0402; Mounted: Yes; Socket: No; SMD: Yes; Sense: No; Manufacturer1 Example: MURATA; Manufacturer1 ComponentHeight: 0.55mm; HelpURL: \\cern.ch\dfs\Applications\Altium\Datasheets\CC0402_X7R_MURATA_GRM.pdf; Author: CERN DEM JLC; CreateDate: 2013-12-05; LatestRevisionDate: 2007-12-03
D5 = BAV199: Serial Diode; Part Description: Low-Leakage Double Diode; Manufacturer: NXP SEMICONDUCTORS; Voltage: 75V; Power: 250mW; PressFit: No; Bonding: No; Part Number: BAV199; Component Kind: Standard; Component Type: Standard; Device: BAV199; PackageDescription: SOT23 3-Leads, Pitch 0.95mm - Body 1.4x3mm, IPC Medium Density; Manufacturer Part Number: BAV199; Pin Count: 3; Case: SOT23-3; Mounted: Yes; Socket: No; SMD: Yes; Sense: No; ComponentHeight: 1.1mm; HelpURL: \\cern.ch\dfs\Applications\Altium\Datasheets\BAV199.pdf; Author: CERN DEM JMW; CreateDate: 2008-11-21; LatestRevisionDate: 2008-11-21
IC2 = OA_OPA197: 36-V, Precision, Rail-to-Rail Input/Output, Low Offset Voltage, Operational Amplifiers; Manufacturer: TEXAS INSTRUMENTS; PressFit: No; Bonding: No; Part Number: OPA197ID; Component Kind: Standard; Component Type: Standard; Device: OPA197ID; PackageDescription: SOIC 8, Pitch 1.27mm - Body 4x5mm, IPC Medium Density; Part Description: 36-V, Precision, Rail-to-Rail Input/Output, Low Offset Voltage, Operational Amplifiers; Manufacturer Part Number: OPA197ID; Pin Count: 5; Case: SOIC8; Mounted: Yes; Socket: No; SMD: Yes; Sense: No; ComponentHeight: 1.75mm; Author: GK; HelpURL: \\cern.ch\dfs\Applications\Altium\Datasheets\OPA192ID.pdf; CreateDate: 22.07.2015; LatestRevisionDate: 22.07.2015
L4 = IND_6.5MH_50%_WURTH_WE-SL2-744229: Inductor Common Mode; Part Description: Common Mode SMD Line Filter (WE-SL2 Serie); Manufacturer: WURTH ELEKTRONIK; Manufacturer Part Number: 744229; Power: 400mA; Resistance: 0.95R; Tolerance: ±50%; Part Number: IND_6.5MH_50%_WURTH_WE-SL2-744229; Component Kind: Standard; Component Type: Standard; Pin Count: 4; Value: 2x6.5mH; Status: None; Mounted: Yes; Socket: No; SMD: Yes; Sense: No; ComponentHeight: 5.3mm; HelpURL: \\cern.ch\dfs\Applications\Altium\Datasheets\IND_WURTH_WE-SL2_744229.pdf; Author: CERN DEM JLC; CreateDate: 01.10.2012; LatestRevisionDate: 15.10.2012
R5 R7 = R0603_1K_1%_0.1W_100PPM: as R40 on sheet Supply_DAC; Part Number: R0603_1K_1%_0.1W_100PPM; Component Kind: Standard; Component Type: Standard; Pin Count: 2; Value: 1k; Status: Preferred; Tolerance: ±1%; Manufacturer Part Number: R0603_1K_1%_0.1W_100PPM; Case: 0603; Mounted: Yes; Sense: No; Socket: No; SMD: Yes; Manufacturer1 Example: NIC COMPONENT; Manufacturer1 ComponentHeight: 0.55mm; HelpURL: \\cern.ch\dfs\Applications\Altium\Datasheets\R0603_NIC_NRC.pdf; Author: CERN DEM JLC; CreateDate: 03.12.2007; LatestRevisionDate: 13.03.2008
R24 = R0603_2K32_0.1%_0.063W_10PPM: Resistor - 0.1%; Part Description: Thin Film Chip Resistor; Manufacturer: GENERIC; Manufacturer1 Part Number: RN73C1J2K32BTDF; Power: 0.063W; TC: ±10ppm; Part Number: R0603_2K32_0.1%_0.063W_10PPM; Component Kind: Standard; Component Type: Standard; Pin Count: 2; Value: 2k32; Status: Not recommended; Tolerance: ±0.1%; Manufacturer Part Number: R0603_2K32_0.1%_0.063W_10PPM; Case: 0603; Mounted: Yes; Sense: No; Socket: No; SMD: Yes; Manufacturer1 Example: TYCO HOLSWORTHY; Manufacturer1 ComponentHeight: 0.5mm; HelpURL: \\cern.ch\dfs\Applications\Altium\Datasheets\R0603_Tyco_RN73.pdf; Author: CERN DEM JLC; CreateDate: 03.12.2007; LatestRevisionDate: 13.03.2008
R25 = R0603_9K09_0.1%_0.063W_10PPM: Resistor - 0.1%; Part Description: Thin Film Chip Resistor; Manufacturer: GENERIC; Manufacturer1 Part Number: RN73C1J9K09BTDF; Power: 0.063W; TC: ±10ppm; Part Number: R0603_9K09_0.1%_0.063W_10PPM; Component Kind: Standard; Component Type: Standard; Pin Count: 2; Value: 9k09; Status: Not recommended; Tolerance: ±0.1%; Manufacturer Part Number: R0603_9K09_0.1%_0.063W_10PPM; Case: 0603; Mounted: Yes; Sense: No; Socket: No; SMD: Yes; Manufacturer1 Example: TYCO HOLSWORTHY; Manufacturer1 ComponentHeight: 0.5mm; HelpURL: \\cern.ch\dfs\Applications\Altium\Datasheets\R0603_Tyco_RN73.pdf; Author: CERN DEM JLC; CreateDate: 03.12.2007; LatestRevisionDate: 13.03.2008
R67 = R0603_11K_1%_0.1W_100PPM: Resistor - 1%; Part Description: General Purpose Thick Film Chip Resistor; Manufacturer: GENERIC; Manufacturer1 Part Number: NRC06F1102TRF; Power: 0.1W; TC: ±100ppm/°C; Part Number: R0603_11K_1%_0.1W_100PPM; Component Kind: Standard; Component Type: Standard; Pin Count: 2; Value: 11k; Status: Preferred; Tolerance: ±1%; Manufacturer Part Number: R0603_11K_1%_0.1W_100PPM; Case: 0603; Mounted: Yes; Sense: No; Socket: No; SMD: Yes; Manufacturer1 Example: NIC COMPONENT; Manufacturer1 ComponentHeight: 0.55mm; HelpURL: \\cern.ch\dfs\Applications\Altium\Datasheets\R0603_NIC_NRC.pdf; Author: CERN DEM JLC; CreateDate: 03.12.2007; LatestRevisionDate: 13.03.2008
R68 = R0603_NO-VALUE: as R1 on sheet Supply_DAC; Part Number: R0603_NO-VALUE; Component Kind: Standard; Component Type: Standard; Pin Count: 2; Value: Undefined; Status: None; Manufacturer: Undefined; Manufacturer Part Number: R0603_NO-VALUE; Case: 0603; Sense: No; Socket: No; SMD: Yes; Manufacturer1 Example: Undefined; Manufacturer1 Part Number: Undefined; Manufacturer1 ComponentHeight: Undefined; HelpURL: Undefined; Author: CERN DEM JLC; CreateDate: 03.12.2007; LatestRevisionDate: 13.03.2008